# Altium project RSX_High_Power_Board.PrjPcb (part 2 of 2)
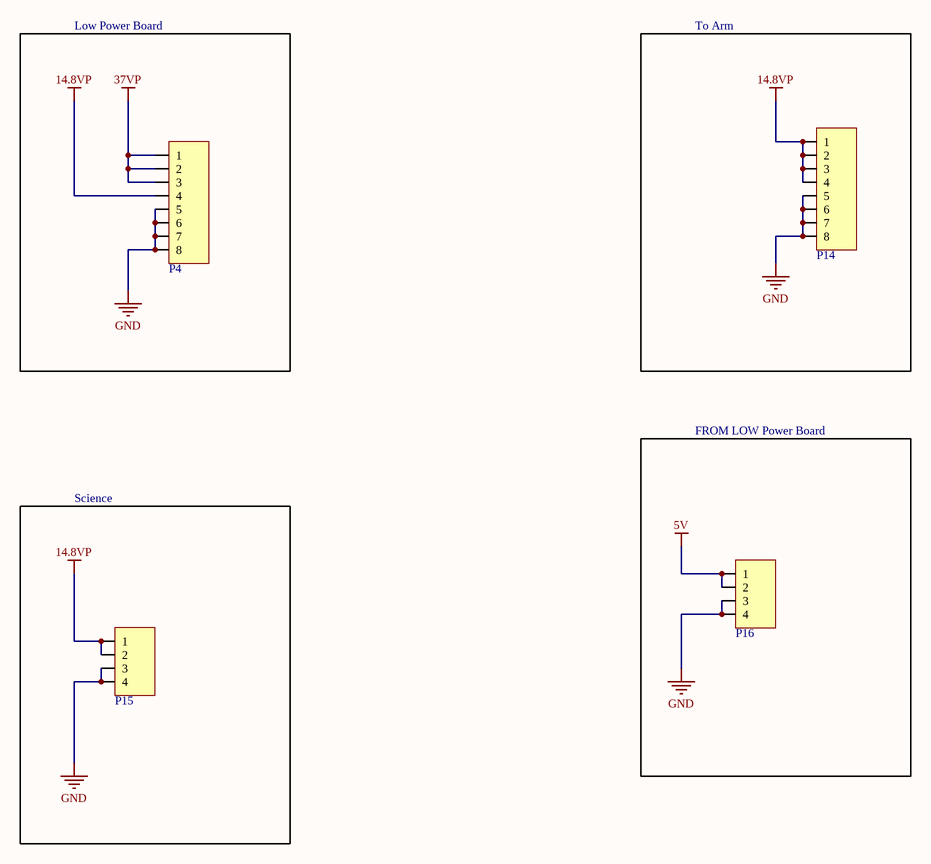
[diagram p11: SCH-11-Out Going Connectors.SchDoc]

## Nets that join several sheets
5V: SCH-1-ESD Power Rails (C16.1 VR2.3), SCH-2-Main Controls (R34.2 R35.2), SCH-3-ESC1 (7 pins), SCH-4-ESC2 (7 pins), SCH-5-ESC3 (7 pins), SCH-6-ESC4 (7 pins), SCH-7-ESC5 (7 pins), SCH-8-ESC6 (7 pins), SCH-11-Out Going Connectors (P16.1 P16.2)
14.8VP: SCH-1-ESD Power Rails (K3.87a R24.1), SCH-2-Main Controls (D4.1), SCH-9-Battery Voltage Indicators (27 pins), SCH-11-Out Going Connectors (7 pins)
14.8VP_RAW: SCH-1-ESD Power Rails (D3.1 K4.87a), SCH-10-Power Connectors (TH9.1 TH10.1)
37VP: SCH-1-ESD Power Rails (K1.87a), SCH-3-ESC1 (F1.1), SCH-4-ESC2 (F2.1), SCH-5-ESC3 (F3.1), SCH-6-ESC4 (F4.1), SCH-7-ESC5 (F5.1), SCH-8-ESC6 (F6.1), SCH-9-Battery Voltage Indicators (R26.2), SCH-11-Out Going Connectors (P4.1 P4.2 P4.3)
37VP_RAW: SCH-1-ESD Power Rails (D2.1 K2.30), SCH-10-Power Connectors (TH1.1 TH2.1)
GND: SCH-1-ESD Power Rails (14 pins), SCH-2-Main Controls (8 pins), SCH-3-ESC1 (19 pins), SCH-4-ESC2 (19 pins), SCH-5-ESC3 (19 pins), SCH-6-ESC4 (19 pins), SCH-7-ESC5 (19 pins), SCH-8-ESC6 (19 pins), SCH-9-Battery Voltage Indicators (8 pins), SCH-10-Power Connectors (TH7.1 TH8.1 TH11.1 TH12.1), SCH-11-Out Going Connectors (12 pins)
NetARD1_4: SCH-2-Main Controls (ARD1.4), SCH-6-ESC4 (ESC4.27 TP20.1)
NetARD1_5: SCH-2-Main Controls (ARD1.5), SCH-7-ESC5 (ESC5.27 TP25.1)
NetARD1_6: SCH-2-Main Controls (ARD1.6), SCH-8-ESC6 (ESC6.27 TP30.1)
NetARD1_7: SCH-2-Main Controls (ARD1.7), SCH-5-ESC3 (ESC3.27 TP15.1)
NetARD1_8: SCH-2-Main Controls (ARD1.8), SCH-3-ESC1 (ESC1.27 TP5.1)
NetARD1_9: SCH-2-Main Controls (ARD1.9), SCH-4-ESC2 (ESC2.27 TP10.1)
NetARD1_20: SCH-2-Main Controls (ARD1.20 R35.1), SCH-3-ESC1 (U3.4), SCH-4-ESC2 (U1.4), SCH-5-ESC3 (U4.4), SCH-6-ESC4 (U5.4), SCH-7-ESC5 (U6.4), SCH-8-ESC6 (U7.4)
NetARD1_21: SCH-2-Main Controls (ARD1.21 R34.1), SCH-3-ESC1 (U3.3), SCH-4-ESC2 (U1.3), SCH-5-ESC3 (U4.3), SCH-6-ESC4 (U5.3), SCH-7-ESC5 (U6.3), SCH-8-ESC6 (U7.3)
NetARD1_22: SCH-2-Main Controls (ARD1.22), SCH-3-ESC1 (ESC1.20)
NetARD1_23: SCH-2-Main Controls (ARD1.23), SCH-3-ESC1 (ESC1.19 R1.1)
NetARD1_24: SCH-2-Main Controls (ARD1.24), SCH-3-ESC1 (ESC1.22)
NetARD1_25: SCH-2-Main Controls (ARD1.25), SCH-3-ESC1 (ESC1.21)
NetARD1_26: SCH-2-Main Controls (ARD1.26), SCH-4-ESC2 (ESC2.22)
NetARD1_27: SCH-2-Main Controls (ARD1.27), SCH-4-ESC2 (ESC2.21)
NetARD1_28: SCH-2-Main Controls (ARD1.28), SCH-4-ESC2 (ESC2.20)
NetARD1_29: SCH-2-Main Controls (ARD1.29), SCH-4-ESC2 (ESC2.19 R7.1)
NetARD1_30: SCH-2-Main Controls (ARD1.30), SCH-5-ESC3 (ESC3.19 R8.1)
NetARD1_31: SCH-2-Main Controls (ARD1.31), SCH-5-ESC3 (ESC3.20)
NetARD1_32: SCH-2-Main Controls (ARD1.32), SCH-5-ESC3 (ESC3.21)
NetARD1_33: SCH-2-Main Controls (ARD1.33), SCH-5-ESC3 (ESC3.22)
NetARD1_34: SCH-2-Main Controls (ARD1.34), SCH-6-ESC4 (ESC4.21)
NetARD1_35: SCH-2-Main Controls (ARD1.35), SCH-6-ESC4 (ESC4.22)
NetARD1_36: SCH-2-Main Controls (ARD1.36), SCH-6-ESC4 (ESC4.19 R12.1)
NetARD1_37: SCH-2-Main Controls (ARD1.37), SCH-6-ESC4 (ESC4.20)
NetARD1_38: SCH-2-Main Controls (ARD1.38), SCH-7-ESC5 (ESC5.21)
NetARD1_39: SCH-2-Main Controls (ARD1.39), SCH-7-ESC5 (ESC5.22)
NetARD1_40: SCH-2-Main Controls (ARD1.40), SCH-7-ESC5 (ESC5.19 R16.1)
NetARD1_41: SCH-2-Main Controls (ARD1.41), SCH-7-ESC5 (ESC5.20)
NetARD1_42: SCH-2-Main Controls (ARD1.42), SCH-8-ESC6 (ESC6.19 R20.1)
NetARD1_43: SCH-2-Main Controls (ARD1.43), SCH-8-ESC6 (ESC6.20)
NetARD1_44: SCH-2-Main Controls (ARD1.44), SCH-8-ESC6 (ESC6.21)
NetARD1_45: SCH-2-Main Controls (ARD1.45), SCH-8-ESC6 (ESC6.22)
NetARD1_60: SCH-2-Main Controls (ARD1.60), SCH-8-ESC6 (ESC6.24)
NetARD1_61: SCH-2-Main Controls (ARD1.61), SCH-8-ESC6 (ESC6.25)
NetARD1_62: SCH-2-Main Controls (ARD1.62), SCH-7-ESC5 (ESC5.24)
NetARD1_63: SCH-2-Main Controls (ARD1.63), SCH-7-ESC5 (ESC5.25)
NetARD1_64: SCH-2-Main Controls (ARD1.64), SCH-6-ESC4 (ESC4.24)
NetARD1_65: SCH-2-Main Controls (ARD1.65), SCH-6-ESC4 (ESC4.25)
NetARD1_66: SCH-2-Main Controls (ARD1.66), SCH-3-ESC1 (ESC1.25)
NetARD1_67: SCH-2-Main Controls (ARD1.67), SCH-3-ESC1 (ESC1.24)
NetARD1_68: SCH-2-Main Controls (ARD1.68), SCH-4-ESC2 (ESC2.25)
NetARD1_69: SCH-2-Main Controls (ARD1.69), SCH-4-ESC2 (ESC2.24)
NetARD1_70: SCH-2-Main Controls (ARD1.70), SCH-5-ESC3 (ESC3.25)
NetARD1_71: SCH-2-Main Controls (ARD1.71), SCH-5-ESC3 (ESC3.24)